# EAGLE schematic vocore2-motherboard (EAGLE 9.3.2)

## Sheet 1 of 4: Power
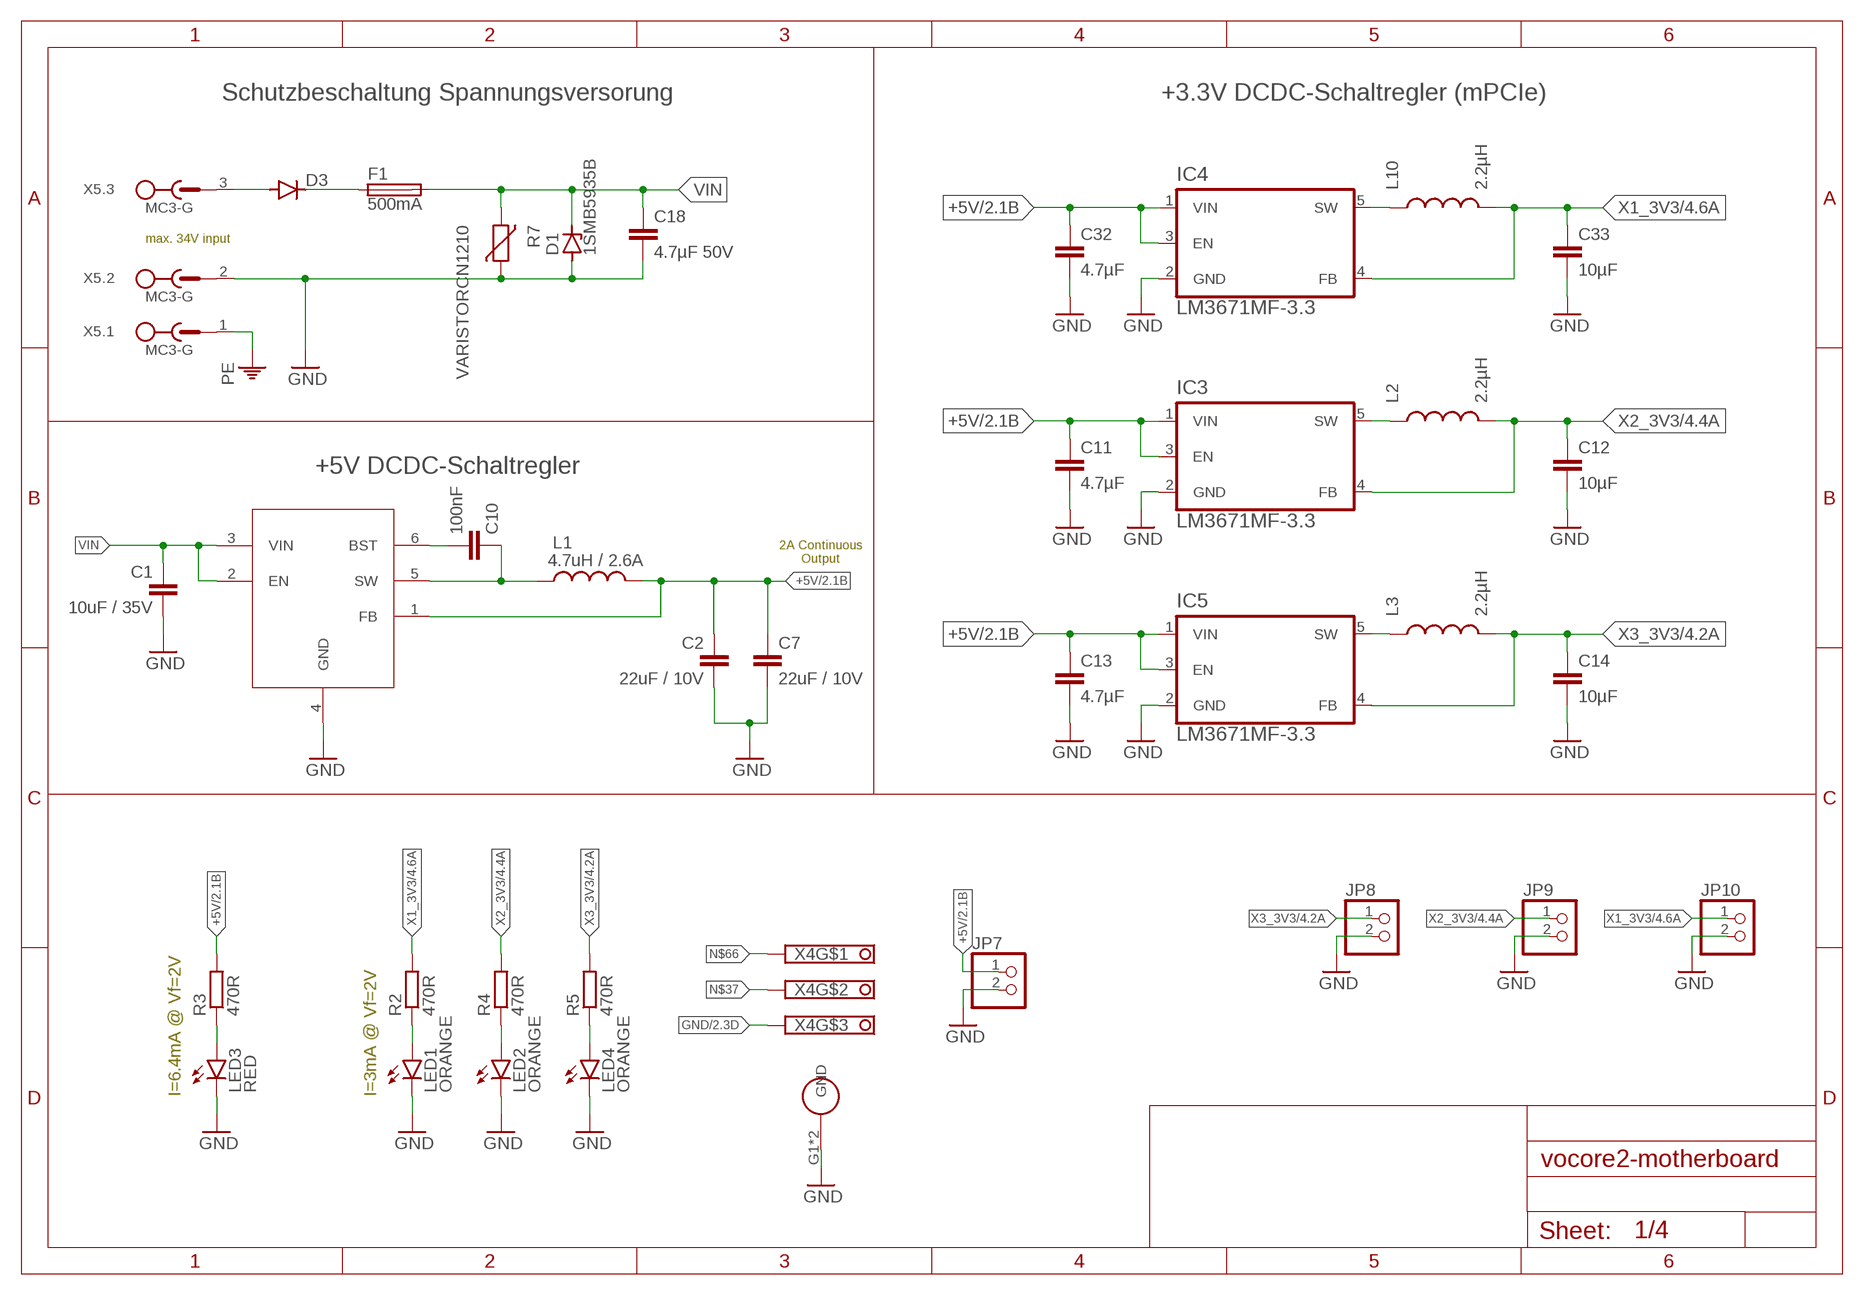
[diagram p0: schematic, sheet 1]

### Parts
C1  10uF / 35V  C-EUC0805  [C0805]
C2  22uF / 10V  C-EUC0805  [C0805]
C7  22uF / 10V  C-EUC0805  [C0805]
C10  100nF  C-EUC0805  [C0805]
C11  4.7µF  C-EUC0603  [C0603]
C12  10µF  C-EUC0603  [C0603]
C13  4.7µF  C-EUC0603  [C0603]
C14  10µF  C-EUC0603  [C0603]
C18  4.7µF 50V  C-EUC1206  [C1206]
C32  4.7µF  C-EUC0603  [C0603]
C33  10µF  C-EUC0603  [C0603]
D1  1SMB5935B  ZENER-DIODESMB  [SMB]
D3  DIODE-SMB  [SMB]
F1  500mA  SMD-FUSE-1812  [1812]
IC1  AP63205  [SOT23-6]
IC3  LM3671MF-3.3  LM3671  [SOT95P284X122-5N]
IC4  LM3671MF-3.3  LM3671  [SOT95P284X122-5N]
IC5  LM3671MF-3.3  LM3671  [SOT95P284X122-5N]
JP7  PINHD-1X2_2.54  [1X02]
JP8  PINHD-1X2  [1X02]
JP9  PINHD-1X2  [1X02]
JP10  PINHD-1X2  [1X02]
L1  4.7uH / 2.6A  L4.90X4.90  [4.90X4.90]
L2  2.2µH  DO3314  [SO3314]
L3  2.2µH  DO3314  [SO3314]
L10  2.2µH  DO3314  [SO3314]
LED1  ORANGE  LEDCHIP-LED0805  [CHIP-LED0805]
LED2  ORANGE  LEDCHIP-LED0805  [CHIP-LED0805]
LED3  RED  LEDCHIP-LED0805  [CHIP-LED0805]
LED4  ORANGE  LEDCHIP-LED0805  [CHIP-LED0805]
R2  470R  R-EU_R0603  [R0603]
R3  470R  R-EU_R0603  [R0603]
R4  470R  R-EU_R0603  [R0603]
R5  470R  R-EU_R0603  [R0603]
R7  VARISTORCN1210  [CT/CN1210]
X4  BM03B-SRSS-TB  [BM03B-SRSS-TB]
X5  MC3-G  [MC3-G]

### Nets
+5V: C2.1 C7.1 C11.1 C13.1 C32.1 IC1.1(FB) IC3.1(VIN) IC3.3(EN) IC4.1(VIN) IC4.3(EN) IC5.1(VIN) IC5.3(EN) JP7.1 L1.P$2 R3.2 ; also sheet 2
+24V: D3.C F1.1 ; also sheet 3
GND: C1.2 C2.2 C7.2 C11.2 C12.2 C13.2 C14.2 C18.2 C32.2 C33.2 D1.A IC1.4(GND) IC3.2(GND) IC4.2(GND) IC5.2(GND) JP7.2 JP8.2 JP9.2 JP10.2 LED1.C LED2.C LED3.C LED4.C R7.1 X4.3 X4.G1 X4.G2 X5.2 ; also sheet 2,3,4
N$5: C10.1 IC1.5(SW) L1.P$1
N$6: IC3.5(SW) L2.1
N$8: IC5.5(SW) L3.1
N$10: LED3.A R3.1
N$13: LED1.A R2.1
N$14: LED2.A R4.1
N$15: LED4.A R5.1
N$37: X4.2 ; also sheet 3
N$50: IC4.5(SW) L10.1
N$60: D3.A X5.3
N$65: C10.2 IC1.6(BST)
N$66: X4.1 ; also sheet 3
PE: X5.1
VIN: C1.1 C18.1 D1.C F1.2 IC1.2(EN) IC1.3(VIN) R7.2
X1_3V3: C33.1 IC4.4(FB) JP10.1 L10.2 R2.2 ; also sheet 4
X2_3V3: C12.1 IC3.4(FB) JP9.1 L2.2 R4.2 ; also sheet 4
X3_3V3: C14.1 IC5.4(FB) JP8.1 L3.2 R5.2 ; also sheet 4

### Notes on the sheet
- Schutzbeschaltung Spannungsversorung | +3.3V DCDC-Schaltregler (mPCIe)
- max. 34V input
- +5V DCDC-Schaltregler
- 2A Continuous
  Output
- I=6.4mA @ Vf=2V | I=3mA @ Vf=2V

## Sheet 2 of 4: VoCore & UART Bridge
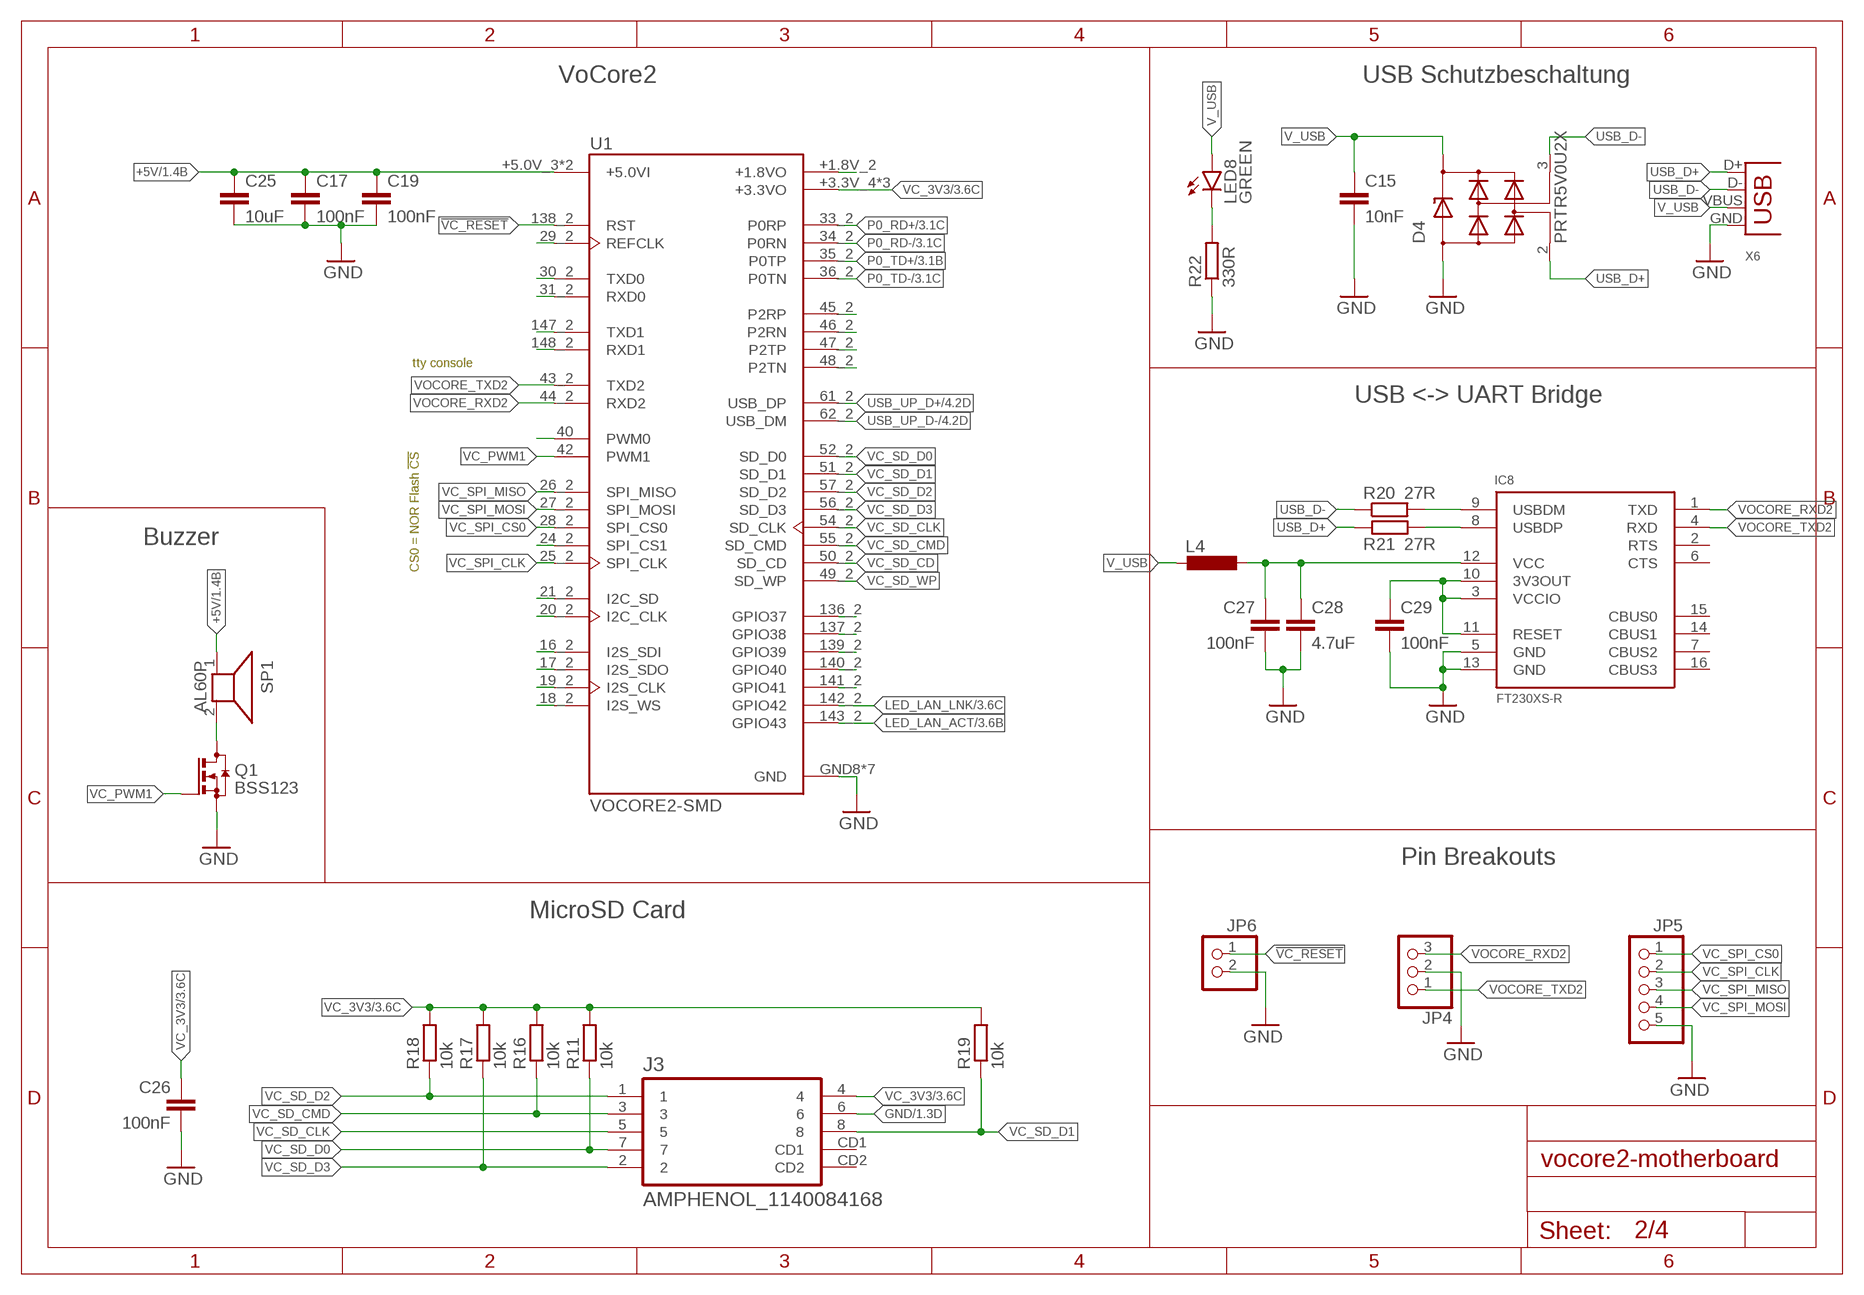
[diagram p1: schematic, sheet 2]

### Parts
C15  10nF  C-EUC0603  [C0603]
C17  100nF  C-EUC0603  [C0603]
C19  100nF  C-EUC0603  [C0603]
C25  10uF  C-EUC0603  [C0603]
C26  100nF  C-EUC0603  [C0603]
C27  100nF  C-EUC0603  [C0603]
C28  4.7uF  C-EUC0603  [C0603]
C29  100nF  C-EUC0603  [C0603]
D4  PRTR5V0U2X  [SOT143]
IC8  FT230XS-R  [SSOP16-0.635-5X4MM]
J3  AMPHENOL_1140084168  [AMPHENOL_1140084168]
JP4  PINHD-1X3  [1X03]
JP5  PINHD-1X5  [1X05]
JP6  PINHD-1X2_2.54  [1X02]
L4  L-EUL0805  [L0805]
LED8  GREEN  LEDCHIP-LED0805  [CHIP-LED0805]
Q1  BSS123  [SOT23]
R11  10k  R-EU_R0603  [R0603]
R16  10k  R-EU_R0603  [R0603]
R17  10k  R-EU_R0603  [R0603]
R18  10k  R-EU_R0603  [R0603]
R19  10k  R-EU_R0603  [R0603]
R20  27R  R-EU_R0603  [R0603]
R21  27R  R-EU_R0603  [R0603]
R22  330R  R-EU_R0603  [R0603]
SP1  AL60P  [AL60P]
U1  VOCORE2-SMD  [VOCORE2_SMD]
X6  USB-MB-S  [USB-MB-S]

### Nets
!VC_RESET: JP6.1 U1.138_2(RST)
+5V: C17.1 C19.1 C25.1 SP1.1 U1.+5.0V_3(+5.0VI) U1.+5.0V_4(+5.0VI) ; also sheet 1
FT230_VCCIO: C29.1 IC8.3(VCCIO) IC8.10(3V3OUT) IC8.11(RESET)
GND: C15.2 C17.2 C19.2 C25.2 C26.2 C27.2 C28.2 C29.2 D4.1(GND) IC8.5(GND) IC8.13(GND) J3.6 JP4.2 JP5.5 JP6.2 Q1.2(S) R22.1 U1.GND8(GND) U1.GND9(GND) U1.GND10(GND) U1.GND11(GND) U1.GND12(GND) U1.GND13(GND) U1.GND14(GND) X6.GND ; also sheet 1,3,4
LED_LAN_ACT: U1.143_2(GPIO43) ; also sheet 3
LED_LAN_LNK: U1.142_2(GPIO42) ; also sheet 3
N$19: U1.24_2(SPI_CS1)
N$21: Q1.3(D) SP1.2
N$22: U1.40(PWM0)
N$23: U1.148_2(RXD1)
N$24: U1.147_2(TXD1)
N$25: U1.30_2(TXD0)
N$26: U1.31_2(RXD0)
N$27: U1.29_2(REFCLK)
N$29: U1.45_2(P2RP)
N$30: U1.46_2(P2RN)
N$31: U1.47_2(P2TP)
N$32: U1.48_2(P2TN)
N$34: U1.136_2(GPIO37)
N$35: C27.1 C28.1 IC8.12(VCC) L4.1
N$36: IC8.9(USBDM) R20.2
N$38: IC8.8(USBDP) R21.1
N$39: LED8.C R22.2
N$43: U1.139_2(GPIO39)
N$44: U1.140_2(GPIO40)
N$45: U1.141_2(GPIO41)
N$48: U1.+1.8V_2(+1.8VO)
N$49: U1.18_2(I2S_WS)
N$51: U1.19_2(I2S_CLK)
N$52: U1.17_2(I2S_SDO)
N$53: U1.16_2(I2S_SDI)
N$54: U1.20_2(I2C_CLK)
N$55: U1.21_2(I2C_SD)
N$35165: U1.137_2(GPIO38)
P0_RD+: U1.33_2(P0RP) ; also sheet 3
P0_RD-: U1.34_2(P0RN) ; also sheet 3
P0_TD+: U1.35_2(P0TP) ; also sheet 3
P0_TD-: U1.36_2(P0TN) ; also sheet 3
USB_D+: D4.2(IO1) R21.2 X6.D+
USB_D-: D4.3(IO2) R20.1 X6.D-
USB_UP_D+: U1.61_2(USB_DP) ; also sheet 4
USB_UP_D-: U1.62_2(USB_DM) ; also sheet 4
V_USB: C15.1 D4.4(VCC) L4.2 LED8.A X6.VBUS
VC_3V3: C26.1 J3.4 R11.2 R16.2 R17.2 R18.2 R19.2 U1.+3.3V_4(+3.3VO) U1.+3.3V_5(+3.3VO) U1.+3.3V_6(+3.3VO) ; also sheet 3,4
VC_PWM1: Q1.1(G) U1.42(PWM1)
VC_SD_CD: U1.50_2(SD_CD)
VC_SD_CLK: J3.5 U1.54_2(SD_CLK)
VC_SD_CMD: J3.3 R16.1 U1.55_2(SD_CMD)
VC_SD_D0: J3.7 R11.1 U1.52_2(SD_D0)
VC_SD_D1: J3.8 R19.1 U1.51_2(SD_D1)
VC_SD_D2: J3.1 R18.1 U1.57_2(SD_D2)
VC_SD_D3: J3.2 R17.1 U1.56_2(SD_D3)
VC_SD_WP: U1.49_2(SD_WP)
VC_SPI_CLK: JP5.2 U1.25_2(SPI_CLK)
VC_SPI_CS0: JP5.1 U1.28_2(SPI_CS0)
VC_SPI_MISO: JP5.3 U1.26_2(SPI_MISO)
VC_SPI_MOSI: JP5.4 U1.27_2(SPI_MOSI)
VOCORE_RXD2: IC8.1(TXD) JP4.3 U1.44_2(RXD2)
VOCORE_TXD2: IC8.4(RXD) JP4.1 U1.43_2(TXD2)
Unconnected: IC8.2(RTS) IC8.6(CTS) IC8.7(CBUS2) IC8.14(CBUS1) IC8.15(CBUS0) IC8.16(CBUS3) J3.CD1 J3.CD2

### Notes on the sheet
- VoCore2 | USB Schutzbeschaltung
- tty console
- USB <-> UART Bridge
- Buzzer
- CS0 = NOR Flash !CS
- Pin Breakouts
- MicroSD Card

## Sheet 3 of 4: Ethernet & POE
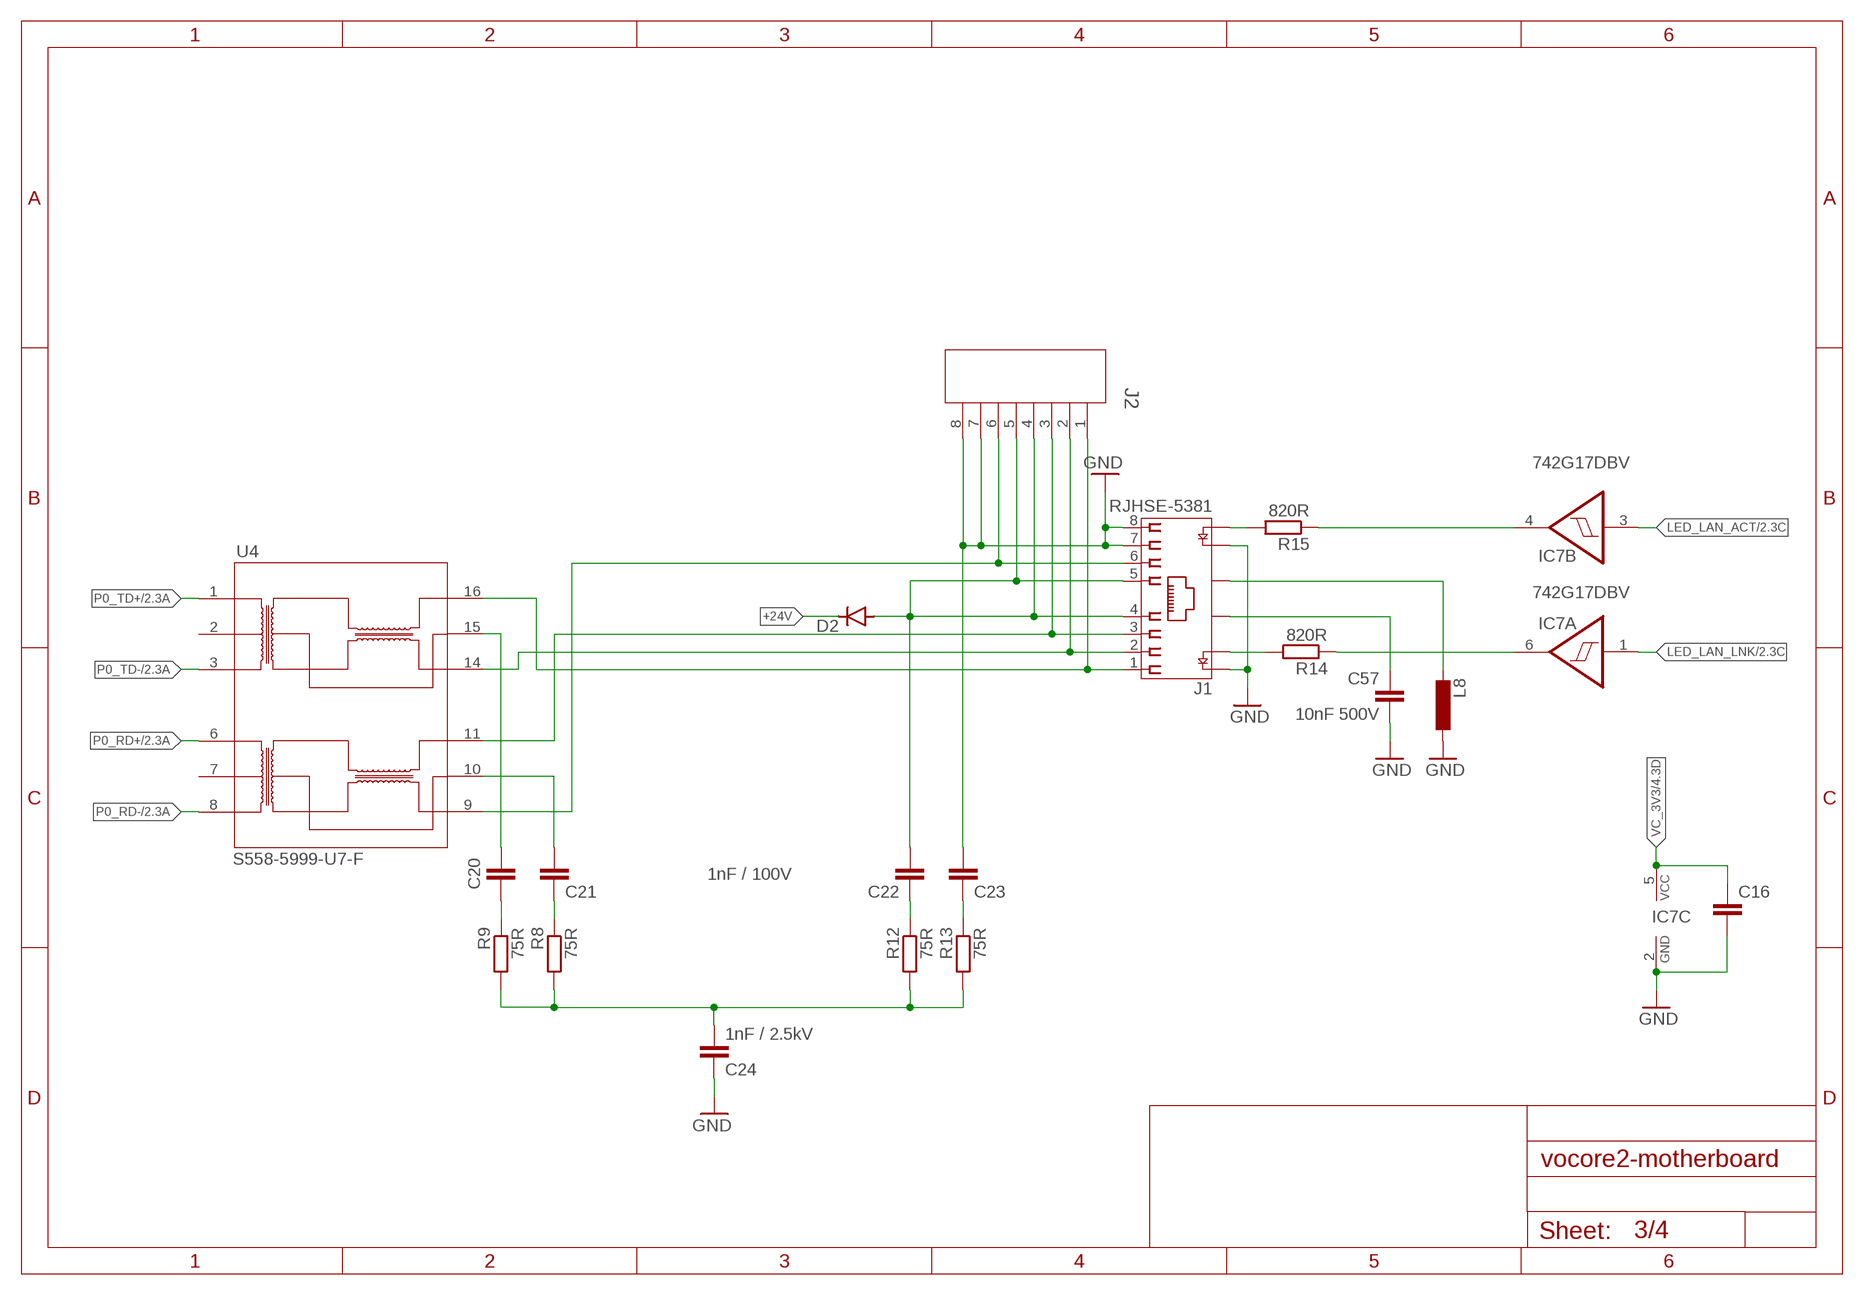
[diagram p2: schematic, sheet 3]

### Parts
C16  100nF  C-EUC0603  [C0603]
C20  1nF / 100V  C-EUC0603  [C0603]
C21  1nF / 100V  C-EUC0603  [C0603]
C22  1nF / 100V  C-EUC0603  [C0603]
C23  1nF / 100V  C-EUC0603  [C0603]
C24  1nF / 2.5kV  C-EUC1808  [C1808]
C57  10nF 500V  C-EUC0805  [C0805]
D2  DIODE-SMB  [SMB]
IC7  742G17DBV  [DBV_R-PDSO-G6]
J1  RJHSE-5381  [AMPHENOL_RJHSE-5381]
J2  TE_1775470-8  [CONN8_1775470-8]
L8  L-EUL0805  [L0805]
R8  75R  R-EU_R0603  [R0603]
R9  75R  R-EU_R0603  [R0603]
R12  75R  R-EU_R0603  [R0603]
R13  75R  R-EU_R0603  [R0603]
R14  820R  R-EU_R0603  [R0603]
R15  820R  R-EU_R0603  [R0603]
U4  S558-5999-U7-F  [S558-5999-U7-F]

### Nets
+24V: D2.C ; also sheet 1
GND: C16.2 C23.2 C24.1 C57.2 IC7.2(C:GND) J1.7 J1.8 J1.9 J1.11 J2.7 J2.8 L8.1 ; also sheet 1,2,4
LED_LAN_ACT: IC7.3(B:I) ; also sheet 2
LED_LAN_LNK: IC7.1(A:I) ; also sheet 2
N$7: C20.2 U4.15(TX_CT)
N$16: C21.2 U4.10(RX_CT)
N$17: C21.1 R8.1
N$18: C20.1 R9.1
N$20: C22.1 R12.1
N$28: C23.1 R13.1
N$33: C24.2 R8.2 R9.2 R12.2 R13.2
N$37: IC7.4(B:O) R15.1 ; also sheet 1
N$41: J1.12 R15.2
N$42: J1.10 R14.2
N$56: J1.S2 L8.2
N$61: C57.1 J1.S1
N$66: IC7.6(A:O) R14.1 ; also sheet 1
P0_RD+: U4.6(RD+) ; also sheet 2
P0_RD-: U4.8(RD-) ; also sheet 2
P0_TD+: U4.1(TD+) ; also sheet 2
P0_TD-: U4.3(TD-) ; also sheet 2
POE_V+: C22.2 D2.A J1.4 J1.5 J2.4 J2.5
RX+: J1.3 J2.3 U4.11(RX+)
RX-: J1.6 J2.6 U4.9(RX-)
TX+: J1.1 J2.1 U4.16(TX+)
TX-: J1.2 J2.2 U4.14(TX-)
VC_3V3: C16.1 IC7.5(C:VCC) ; also sheet 2,4
Unconnected: U4.2(TD_CT) U4.7(RD_CT)

## Sheet 4 of 4: Mini-PCIe & USB-Hub
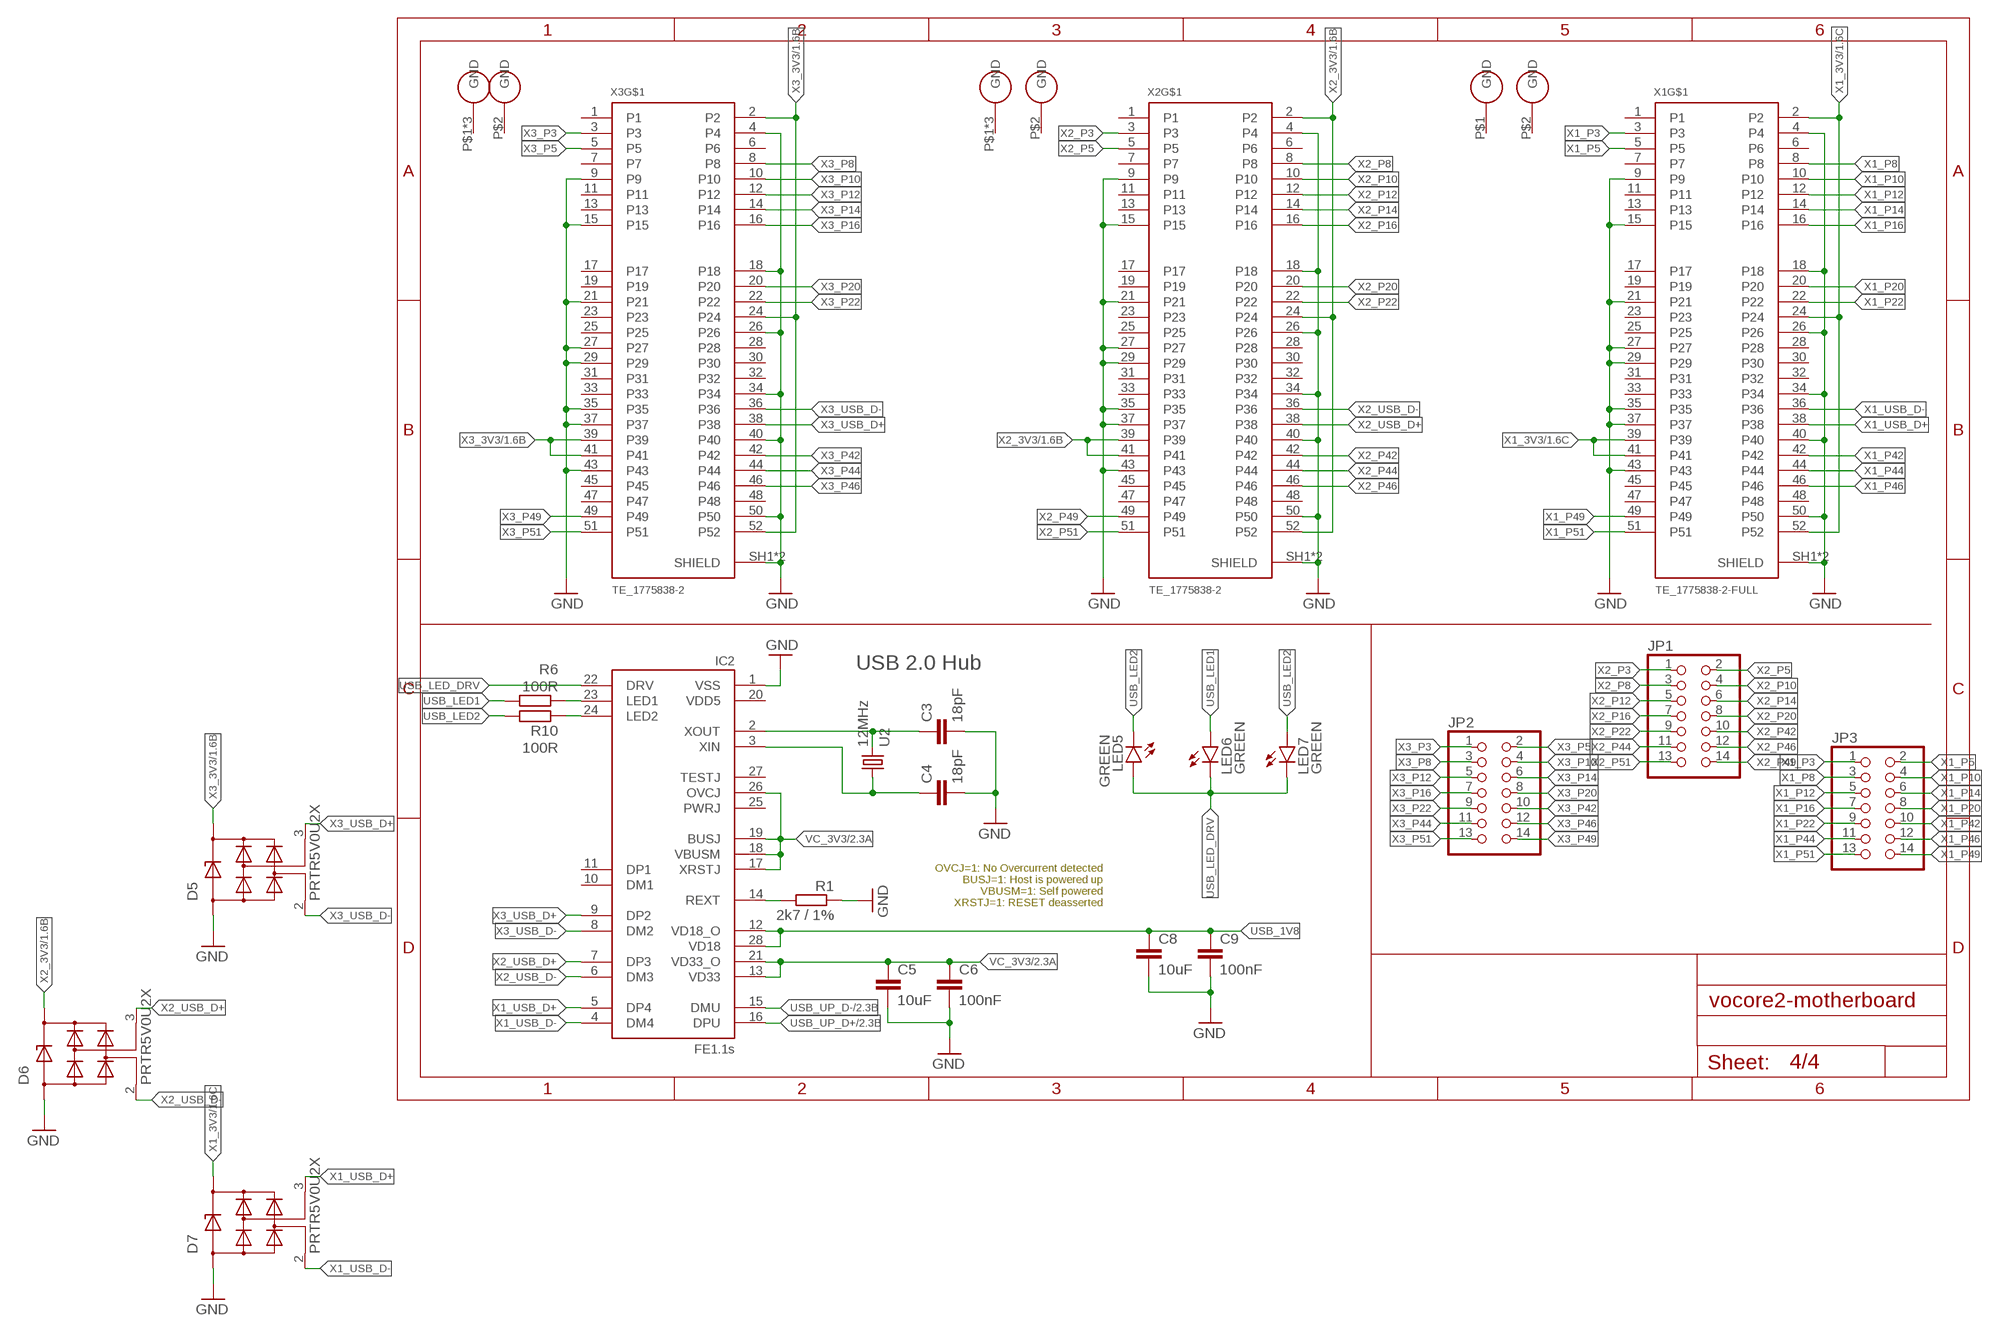
[diagram p3: schematic, sheet 4]

### Parts
C3  18pF  C-EUC0603  [C0603]
C4  18pF  C-EUC0603  [C0603]
C5  10uF  C-EUC0603  [C0603]
C6  100nF  C-EUC0603  [C0603]
C8  10uF  C-EUC0603  [C0603]
C9  100nF  C-EUC0603  [C0603]
D5  PRTR5V0U2X  [SOT143]
D6  PRTR5V0U2X  [SOT143]
D7  PRTR5V0U2X  [SOT143]
IC2  FE1.1S  [FE1.1S_SSOP-28]
JP1  PINHD-2X7  [2X07]
JP2  PINHD-2X7  [2X07]
JP3  PINHD-2X7  [2X07]
LED5  GREEN  LEDCHIP-LED0805  [CHIP-LED0805]
LED6  GREEN  LEDCHIP-LED0805  [CHIP-LED0805]
LED7  GREEN  LEDCHIP-LED0805  [CHIP-LED0805]
R1  2k7 / 1%  R-EU_R0603  [R0603]
R6  100R  R-EU_R0603  [R0603]
R10  100R  R-EU_R0603  [R0603]
U2  12MHz  7A  [7A]
X1  TE_1775838-2-FULL  [TE_1775838-2-FULL]
X2  TE_1775838-2  [TE_1775838-2]
X3  TE_1775838-2  [TE_1775838-2]

### Nets
GND: C3.2 C4.2 C5.2 C6.2 C8.2 C9.2 D5.1(GND) D6.1(GND) D7.1(GND) IC2.1(VSS) R1.1 X1.4 X1.9 X1.15 X1.18 X1.21 X1.26 X1.27 X1.29 X1.34 X1.35 X1.37 X1.40 X1.43 X1.50 X1.SH1(SHIELD) X1.SH2(SHIELD) X2.4 X2.9 X2.15 X2.18 X2.21 X2.26 X2.27 X2.29 X2.34 X2.35 X2.37 X2.40 X2.43 X2.50 X2.SH1(SHIELD) X2.SH2(SHIELD) X3.4 X3.9 X3.15 X3.18 X3.21 X3.26 X3.27 X3.29 X3.34 X3.35 X3.37 X3.40 X3.43 X3.50 X3.SH1(SHIELD) X3.SH2(SHIELD) ; also sheet 1,2,3
N$9: C3.1 IC2.2(XOUT) U2.2
N$11: C4.1 IC2.3(XIN) U2.1
N$12: IC2.14(REXT) R1.2
N$57: IC2.23(LED1) R6.1
N$58: IC2.24(LED2) R10.1
USB_1V8: C8.1 C9.1 IC2.12(VD18_O) IC2.28(VD18)
USB_LED1: LED6.A R6.2
USB_LED2: LED5.C LED7.A R10.2
USB_LED_DRV: IC2.22(DRV) LED5.A LED6.C LED7.C
USB_UP_D+: IC2.16(DPU) ; also sheet 2
USB_UP_D-: IC2.15(DMU) ; also sheet 2
VC_3V3: C5.1 C6.1 IC2.13(VD33) IC2.17(XRSTJ) IC2.18(VBUSM) IC2.19(BUSJ) IC2.21(VD33_O) IC2.26(OVCJ) ; also sheet 2,3
X1_3V3: D7.4(VCC) X1.2 X1.24 X1.39 X1.41 X1.52 ; also sheet 1
X1_P3: JP3.1 X1.3
X1_P5: JP3.2 X1.5
X1_P8: JP3.3 X1.8
X1_P10: JP3.4 X1.10
X1_P12: JP3.5 X1.12
X1_P14: JP3.6 X1.14
X1_P16: JP3.7 X1.16
X1_P20: JP3.8 X1.20
X1_P22: JP3.9 X1.22
X1_P42: JP3.10 X1.42
X1_P44: JP3.11 X1.44
X1_P46: JP3.12 X1.46
X1_P49: JP3.14 X1.49
X1_P51: JP3.13 X1.51
X1_USB_D+: D7.3(IO2) IC2.5(DP4) X1.38
X1_USB_D-: D7.2(IO1) IC2.4(DM4) X1.36
X2_3V3: D6.4(VCC) X2.2 X2.24 X2.39 X2.41 X2.52 ; also sheet 1
X2_P3: JP1.1 X2.3
X2_P5: JP1.2 X2.5
X2_P8: JP1.3 X2.8
X2_P10: JP1.4 X2.10
X2_P12: JP1.5 X2.12
X2_P14: JP1.6 X2.14
X2_P16: JP1.7 X2.16
X2_P20: JP1.8 X2.20
X2_P22: JP1.9 X2.22
X2_P42: JP1.10 X2.42
X2_P44: JP1.11 X2.44
X2_P46: JP1.12 X2.46
X2_P49: JP1.14 X2.49
X2_P51: JP1.13 X2.51
X2_USB_D+: D6.3(IO2) IC2.7(DP3) X2.38
X2_USB_D-: D6.2(IO1) IC2.6(DM3) X2.36
X3_3V3: D5.4(VCC) X3.2 X3.24 X3.39 X3.41 X3.52 ; also sheet 1
X3_P3: JP2.1 X3.3
X3_P5: JP2.2 X3.5
X3_P8: JP2.3 X3.8
X3_P10: JP2.4 X3.10
X3_P12: JP2.5 X3.12
X3_P14: JP2.6 X3.14
X3_P16: JP2.7 X3.16
X3_P20: JP2.8 X3.20
X3_P22: JP2.9 X3.22
X3_P42: JP2.10 X3.42
X3_P44: JP2.11 X3.44
X3_P46: JP2.12 X3.46
X3_P49: JP2.14 X3.49
X3_P51: JP2.13 X3.51
X3_USB_D+: D5.3(IO2) IC2.9(DP2) X3.38
X3_USB_D-: D5.2(IO1) IC2.8(DM2) X3.36
Unconnected: IC2.10(DM1) IC2.11(DP1) IC2.20(VDD5) IC2.25(PWRJ) IC2.27(TESTJ) X1.1 X1.6 X1.7 X1.11 X1.13 X1.17 X1.19 X1.23 X1.25 X1.28 X1.30 X1.31 X1.32 X1.33 X1.45 X1.47 X1.48 X2.1 X2.6 X2.7 X2.11 X2.13 X2.17 X2.19 X2.23 X2.25 X2.28 X2.30 X2.31 X2.32 X2.33 X2.45 X2.47 X2.48 X3.1 X3.6 X3.7 X3.11 X3.13 X3.17 X3.19 X3.23 X3.25 X3.28 X3.30 X3.31 X3.32 X3.33 X3.45 X3.47 X3.48

### Notes on the sheet
- USB 2.0 Hub
- OVCJ=1: No Overcurrent detected
  BUSJ=1: Host is powered up
  VBUSM=1: Self powered
  XRSTJ=1: RESET deasserted

## Power pins joined to a net without a drawn wire
GND: X1.P$1(GND) X1.P$2(GND) X2.P$1(GND) X2.P$2(GND) X2.P$3(GND) X2.P$4(GND) X3.P$1(GND) X3.P$2(GND) X3.P$3(GND) X3.P$4(GND)

## Library data of the parts
C1 = rcl:C-EU: CAPACITOR, European symbol; DIGIKEY: 490-13248-1-ND; LCSC: C162422; SPICEPREFIX: C
C2 C7 = rcl:C-EU: CAPACITOR, European symbol; DIGIKEY: 490-10511-1-ND; SPICEPREFIX: C
C3-C6 C8-C10 C17 C19 C25 = rcl:C-EU: CAPACITOR, European symbol; SPICEPREFIX: C
C11 C13 C32 = rcl:C-EU: CAPACITOR, European symbol; DIGIKEY: 1276-2087-1-ND
C12 C14 C33 = rcl:C-EU: CAPACITOR, European symbol; BUERKLIN: 53D2088; MBM: 10; PREIS: 0,29
C15 = rcl:C-EU: CAPACITOR, European symbol; BUERKLIN: 56D144; MBM: 1; PREIS: 0,04
C16 C20-C23 = rcl:C-EU: CAPACITOR, European symbol; DIGIKEY: 490-4780-1-ND; SPICEPREFIX: C
C18 = rcl:C-EU: CAPACITOR, European symbol; DIGIKEY: 587-2994-1-ND
C24 = rcl:C-EU: CAPACITOR, European symbol; DIGIKEY: 399-7246-1-ND; SPICEPREFIX: C
C26 = rcl:C-EU: CAPACITOR, European symbol; BUERKLIN: 53D2068; MBM: 10; PREIS: 0,04
C27-C29 = rcl:C-EU: CAPACITOR, European symbol
C57 = rcl:C-EU: CAPACITOR, European symbol; DIGIKEY: 709-1021-1-ND
D1 = diode:ZENER-DIODE: Z-Diode; FARNELL: 1431177; MBM: 10; PREIS: 0,106
D2 D3 = diode:DIODE-: DIODE; FARNELL: 1858651; LCSC: C110478
D4-D7 = diode:PRTR5V0U2X: Ultra low capacitance double rail-to-rail ESD protection TVS diode; DIGIKEY: 1727-3884-1-ND; FARNELL: 1524157
F1 = C-Mount3.1:SMD-FUSE-1812; LCSC: C17313
IC1 = pachl-dcdc:AP63205: 3.8V TO 32V INPUT, 2A LOW IQ SYNCHRONOUS BUCK; DIGIKEY: AP63205WU-7DICT-ND
IC2 = Ai_IC:FE1.1S; SPICEPREFIX: X
IC3-IC5 = texas:LM3671: LM3671 2-MHz, 600-mA Step-Down DC-DC Converter Farnell Order Numbers: MF-3.3 : 1685767 MF-2.5 : 2492196 MF-1.8 : 1685654 MF-1.5 : 2492195 MF-ADJ: 1008256; DIGIKEY: LM3671MF-3.3/NOPBCT-ND; FARNELL: 1685767
IC7 = 74xx-little-de:74*2G17: 74*2G17 Dual Schmitt Trigger Buffer Non-Inverting; DIGIKEY: 296-13010-1-ND
IC8 = ftdi:FT230X: FT230X USB TO BASIC UART IC Datasheet: https://www.ftdichip.com/Support/Documents/DataSheets/ICs/DS_FT230X.pdf; DIGIKEY: 768-1135-1-ND
J1 = RJHSE-5381:RJHSE-5381: connector, mod jack, rt angle pcb, shielded, led1-g, led2-y, single port, rj-45 8 cont; DESCRIPTION: connector, mod jack, rt angle pcb, shielded, led1-g, led2-y, single port, rj-45 8 cont; DIGI-KEY_PART_NUMBER: RJHSE-5381-ND; DIGI-KEY_PURCHASE_URL: https://www.digikey.com/product-detail/en/amphenol-icc-commercial-products/RJHSE-5381/RJHSE-5381-ND/1242694?utm_source=snapeda&utm_medium=aggregator&utm_campaign=symbol; MF: Amphenol ICC; MP: RJHSE-5381; PACKAGE: None
J2 = ethernet-transformer:TE_1775470-8; DIGIKEY: A100058CT-ND
J3 = pachl-con:AMPHENOL_1140084168: MICRO SD CARD PUSH-PULL; DESCRIPTION: Memory Card Connector, Microsd, 8 Position, Full Reel; DIGI-KEY_PART_NUMBER: 114-00841-68-1-ND; DIGI-KEY_PURCHASE_URL: https://www.digikey.com/product-detail/en/amphenol-icc-commercial-products/114-00841-68/114-00841-68-1-ND/2187101?utm_source=snapeda&utm_medium=aggregator&utm_campaign=symbol; MF: Amphenol ICC; MP: 114-00841-68; PACKAGE: None
JP1-JP3 = pinhead:PINHD-2X7: PIN HEADER
JP4 = pinhead:PINHD-1X3: PIN HEADER
JP5 = pinhead:PINHD-1X5: PIN HEADER
JP6 JP7 = pinhead-1:PINHD-1X2: PIN HEADER
JP8-JP10 = pinhead:PINHD-1X2: PIN HEADER
L1 = rcld:L: Inductor; DIGIKEY: 587-3605-2-ND
L2 L3 L10 = inductor-coilcraft:DO3314: DO3314; DIGIKEY: 445-8725-1-ND; FARNELL: 2457514
L4 L8 = rcl:L-EU: INDUCTOR, European symbol; DIGIKEY: 490-1054-1-ND
LED1 LED2 LED4 = led:LED: LED OSRAM: - CHIPLED LG R971, LG N971, LY N971, LG Q971, LY Q971, LO R971, LY R971 LH N974, LH R974 LS Q976, LO Q976, LY Q976 LO Q996 - Hyper CHIPLED LW Q18S LB Q993, LB Q99A, LB R99A - SideLED LS A670, LO A670, LY A670, LG A670, LP A670 LB A673, LV A673, LT A673, LW A673 LH A674 LY A675 LS A676, LA A676, LO A676, LY A676, LW A676 LS A679, LY A679, LG A679 - Hyper Micro SIDELED® LS Y876, LA Y876, LO Y876, LY Y876 LT Y87S - SmartLED LW L88C, LW L88S LB L89C, LB L89S, LG L890 LS L89K, LO L89K, LY L89K LS L896, LA L896, LO L896, LY L896 - TOPLED LS T670, LO T670, LY T670, LG T670, LP T670 LSG T670, LSP T670, LSY T670, LOP T670, LYG T670 LG T671, LOG T671, LSG T671 LB T673, LV T673, LT T673, LW T673 LH T674 LS T676, LA T676, LO T676, LY T676, LB T676, LH T676, LSB T676, LW T676 LB T67C, LV T67C, LT T67C, LS T67K, LO T67K, LY T67K, LW E67C LS E67B, LA E67B, LO E67B, LY E67B, LB E67C, LV E67C, LT E67C LW T67C LS T679, LY T679, LG T679 LS T770, LO T770, LY T770, LG T770, LP T770 LB T773, LV T773, LT T773, LW T773 LH T774 LS E675, LA E675, LY E675, LS T675 LS T776, LA T776, LO T776, LY T776, LB T776 LHGB T686 LT T68C, LB T68C - Hyper Mini TOPLED® LB M676 - Mini TOPLED Santana® LG M470 LS M47K, LO M47K, LY M47K Source: http://www.osram.convergy.de LUXEON: - LUMILED® LXK2-PW12-R00, LXK2-PW12-S00, LXK2-PW14-U00, LXK2-PW14-V00 LXK2-PM12-R00, LXK2-PM12-S00, LXK2-PM14-U00 LXK2-PE12-Q00, LXK2-PE12-R00, LXK2-PE12-S00, LXK2-PE14-T00, LXK2-PE14-U00 LXK2-PB12-K00, LXK2-PB12-L00, LXK2-PB12-M00, LXK2-PB14-N00, LXK2-PB14-P00, LXK2-PB14-Q00 LXK2-PR12-L00, LXK2-PR12-M00, LXK2-PR14-Q00, LXK2-PR14-R00 LXK2-PD12-Q00, LXK2-PD12-R00, LXK2-PD12-S00 LXK2-PH12-R00, LXK2-PH12-S00 LXK2-PL12-P00, LXK2-PL12-Q00, LXK2-PL12-R00 Source: www.luxeon.com KINGBRIGHT: KA-3528ASYC Source: www.kingbright.com; DIGIKEY: 160-1445-1-ND
LED3 = led:LED: LED OSRAM: - CHIPLED LG R971, LG N971, LY N971, LG Q971, LY Q971, LO R971, LY R971 LH N974, LH R974 LS Q976, LO Q976, LY Q976 LO Q996 - Hyper CHIPLED LW Q18S LB Q993, LB Q99A, LB R99A - SideLED LS A670, LO A670, LY A670, LG A670, LP A670 LB A673, LV A673, LT A673, LW A673 LH A674 LY A675 LS A676, LA A676, LO A676, LY A676, LW A676 LS A679, LY A679, LG A679 - Hyper Micro SIDELED® LS Y876, LA Y876, LO Y876, LY Y876 LT Y87S - SmartLED LW L88C, LW L88S LB L89C, LB L89S, LG L890 LS L89K, LO L89K, LY L89K LS L896, LA L896, LO L896, LY L896 - TOPLED LS T670, LO T670, LY T670, LG T670, LP T670 LSG T670, LSP T670, LSY T670, LOP T670, LYG T670 LG T671, LOG T671, LSG T671 LB T673, LV T673, LT T673, LW T673 LH T674 LS T676, LA T676, LO T676, LY T676, LB T676, LH T676, LSB T676, LW T676 LB T67C, LV T67C, LT T67C, LS T67K, LO T67K, LY T67K, LW E67C LS E67B, LA E67B, LO E67B, LY E67B, LB E67C, LV E67C, LT E67C LW T67C LS T679, LY T679, LG T679 LS T770, LO T770, LY T770, LG T770, LP T770 LB T773, LV T773, LT T773, LW T773 LH T774 LS E675, LA E675, LY E675, LS T675 LS T776, LA T776, LO T776, LY T776, LB T776 LHGB T686 LT T68C, LB T68C - Hyper Mini TOPLED® LB M676 - Mini TOPLED Santana® LG M470 LS M47K, LO M47K, LY M47K Source: http://www.osram.convergy.de LUXEON: - LUMILED® LXK2-PW12-R00, LXK2-PW12-S00, LXK2-PW14-U00, LXK2-PW14-V00 LXK2-PM12-R00, LXK2-PM12-S00, LXK2-PM14-U00 LXK2-PE12-Q00, LXK2-PE12-R00, LXK2-PE12-S00, LXK2-PE14-T00, LXK2-PE14-U00 LXK2-PB12-K00, LXK2-PB12-L00, LXK2-PB12-M00, LXK2-PB14-N00, LXK2-PB14-P00, LXK2-PB14-Q00 LXK2-PR12-L00, LXK2-PR12-M00, LXK2-PR14-Q00, LXK2-PR14-R00 LXK2-PD12-Q00, LXK2-PD12-R00, LXK2-PD12-S00 LXK2-PH12-R00, LXK2-PH12-S00 LXK2-PL12-P00, LXK2-PL12-Q00, LXK2-PL12-R00 Source: www.luxeon.com KINGBRIGHT: KA-3528ASYC Source: www.kingbright.com; DIGIKEY: 160-1447-1-ND
LED5-LED8 = led:LED: LED OSRAM: - CHIPLED LG R971, LG N971, LY N971, LG Q971, LY Q971, LO R971, LY R971 LH N974, LH R974 LS Q976, LO Q976, LY Q976 LO Q996 - Hyper CHIPLED LW Q18S LB Q993, LB Q99A, LB R99A - SideLED LS A670, LO A670, LY A670, LG A670, LP A670 LB A673, LV A673, LT A673, LW A673 LH A674 LY A675 LS A676, LA A676, LO A676, LY A676, LW A676 LS A679, LY A679, LG A679 - Hyper Micro SIDELED® LS Y876, LA Y876, LO Y876, LY Y876 LT Y87S - SmartLED LW L88C, LW L88S LB L89C, LB L89S, LG L890 LS L89K, LO L89K, LY L89K LS L896, LA L896, LO L896, LY L896 - TOPLED LS T670, LO T670, LY T670, LG T670, LP T670 LSG T670, LSP T670, LSY T670, LOP T670, LYG T670 LG T671, LOG T671, LSG T671 LB T673, LV T673, LT T673, LW T673 LH T674 LS T676, LA T676, LO T676, LY T676, LB T676, LH T676, LSB T676, LW T676 LB T67C, LV T67C, LT T67C, LS T67K, LO T67K, LY T67K, LW E67C LS E67B, LA E67B, LO E67B, LY E67B, LB E67C, LV E67C, LT E67C LW T67C LS T679, LY T679, LG T679 LS T770, LO T770, LY T770, LG T770, LP T770 LB T773, LV T773, LT T773, LW T773 LH T774 LS E675, LA E675, LY E675, LS T675 LS T776, LA T776, LO T776, LY T776, LB T776 LHGB T686 LT T68C, LB T68C - Hyper Mini TOPLED® LB M676 - Mini TOPLED Santana® LG M470 LS M47K, LO M47K, LY M47K Source: http://www.osram.convergy.de LUXEON: - LUMILED® LXK2-PW12-R00, LXK2-PW12-S00, LXK2-PW14-U00, LXK2-PW14-V00 LXK2-PM12-R00, LXK2-PM12-S00, LXK2-PM14-U00 LXK2-PE12-Q00, LXK2-PE12-R00, LXK2-PE12-S00, LXK2-PE14-T00, LXK2-PE14-U00 LXK2-PB12-K00, LXK2-PB12-L00, LXK2-PB12-M00, LXK2-PB14-N00, LXK2-PB14-P00, LXK2-PB14-Q00 LXK2-PR12-L00, LXK2-PR12-M00, LXK2-PR14-Q00, LXK2-PR14-R00 LXK2-PD12-Q00, LXK2-PD12-R00, LXK2-PD12-S00 LXK2-PH12-R00, LXK2-PH12-S00 LXK2-PL12-P00, LXK2-PL12-Q00, LXK2-PL12-R00 Source: www.luxeon.com KINGBRIGHT: KA-3528ASYC Source: www.kingbright.com; DIGIKEY: 160-1446-1-ND
Q1 = transistor-small-signal:BSS123: N-CHANNEL MOS FET; DIGIKEY: BSS123LT1GOSCT-ND‎
R1 = rcl:R-EU_: RESISTOR, European symbol; DIGIKEY: RR08P2.7KDCT-ND; SPICEPREFIX: R
R2-R6 R10 R11 R16-R22 = rcl:R-EU_: RESISTOR, European symbol; SPICEPREFIX: R
R7 = varistor:VARISTOR: VARISTOR; FARNELL: 1636457; MBM: 1; PREIS: 0,84
R8 R9 R12 R13 = rcl:R-EU_: RESISTOR, European symbol; DIGIKEY: RNCP0603FTD75R0CT-ND‎; SPICEPREFIX: R
R14 R15 = rcl:R-EU_: RESISTOR, European symbol; DIGIKEY: A129687CT-ND; SPICEPREFIX: R
SP1 = buzzer:AL60P: SPEAKER Source: Buerklin; LCSC: C252917; OC_FARNELL: unknown; OC_NEWARK: unknown
U1 = VOCORE2:VOCORE2: Coin-sized Linux computer & smart router, target to make wireless life easier, fully open source.
U2 = crystal:7A: 5 x 3.2 mm SMD GLASS CRYSTAL 7A SERIES; FARNELL: 1841940; MBM: 1; PREIS: 1,01; SPICEPREFIX: X
U4 = ethernet-transformer:S558-5999-U7-F: 10/100B-TX Ethernet Transformer; DIGIKEY: 507-1463-1-ND
X1 = pachl-con:TE_1775838-2: Mini PCI Express Card Edge SKT 52 POS Solder RA SMD T/R
X2 = pachl-con:TE_1775838-2: Mini PCI Express Card Edge SKT 52 POS Solder RA SMD T/R; CENTERLINE_PITCH: .8 mm[.031 in]; COMMENT: 1775838-2; DESCRIPTION: mSATA/mini PCI-E 5.6H Type I G/F; DIGI-KEY_PART_NUMBER: A123340CT-ND; DIGI-KEY_PURCHASE_URL: https://www.digikey.com/product-detail/en/te-connectivity-amp-connectors/1775838-2/A123340CT-ND/5451751?utm_source=snapeda&utm_medium=aggregator&utm_campaign=symbol; EU_ROHS_COMPLIANCE: Compliant; MF: TE Connectivity; MP: 1775838-2; NUMBER_OF_POSITIONS: 52; PACKAGE: None; PRODUCT_TYPE: Connector; SPICEPREFIX: X; TE_PURCHASE_URL: https://www.te.com/usa-en/product-1775838-2.html?te_bu=Cor&te_type=disp&te_campaign=seda_glo_cor-seda-global-disp-prtnr-fy19-seda-model-bom-cta_sma-317_1&elqCampaignId=32493
X3 = pachl-con:TE_1775838-2: Mini PCI Express Card Edge SKT 52 POS Solder RA SMD T/R; CENTERLINE_PITCH: .8 mm[.031 in]; COMMENT: 1775838-2; DESCRIPTION: mSATA/mini PCI-E 5.6H Type I G/F; DIGI-KEY_PART_NUMBER: A123340CT-ND; DIGI-KEY_PURCHASE_URL: https://www.digikey.com/product-detail/en/te-connectivity-amp-connectors/1775838-2/A123340CT-ND/5451751?utm_source=snapeda&utm_medium=aggregator&utm_campaign=symbol; EU_ROHS_COMPLIANCE: Compliant; MF: TE Connectivity; MP: 1775838-2; NUMBER_OF_POSITIONS: 52; PACKAGE: None; PRODUCT_TYPE: Connector; TE_PURCHASE_URL: https://www.te.com/usa-en/product-1775838-2.html?te_bu=Cor&te_type=disp&te_campaign=seda_glo_cor-seda-global-disp-prtnr-fy19-seda-model-bom-cta_sma-317_1&elqCampaignId=32493
X4 = con-jst:BM03B-SRSS-TB: 1.0mm displacement connector; DIGIKEY: 455-1789-1-ND
X5 = con-phoenix-381_l:MC3-G: Mini-Combicon 3.81mm horizontal 3-polig MC 1,5/3-G-3,81 Artikel-Nr. 1803280 mit Gegenstecker MC 1,5/3-ST-3,81 Artikel-Nr. 1803581; DIGIKEY: ‎277-1207-ND‎;‎277-13872-ND‎; LCSC: C8406;C8413
X6 = con-usb-3:USB: USB Connectors